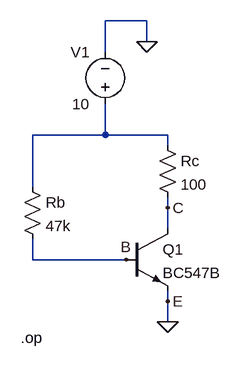
[diagram p0: schematic Fixed Bias Circuit BJT.asc]
Fixed Bias Circuit BJT.asc, the LTspice schematic file:
Version 4
SHEET 1 880 680
WIRE 224 -128 160 -128
WIRE 224 -96 224 -128
WIRE 160 -80 160 -128
WIRE 160 48 160 0
WIRE 160 48 48 48
WIRE 256 48 160 48
WIRE 256 64 256 48
WIRE 48 128 48 48
WIRE 256 160 256 144
WIRE 256 192 256 160
WIRE 48 240 48 208
WIRE 192 240 48 240
WIRE 256 304 256 288
WIRE 256 336 256 304
FLAG 256 336 0
FLAG 224 -96 0
FLAG 192 240 B
FLAG 256 304 E
FLAG 256 160 C
SYMBOL res 32 112 R0
SYMATTR InstName Rb
SYMATTR Value 47k
SYMBOL res 240 48 R0
SYMATTR InstName Rc
SYMATTR Value 100
SYMBOL npn 192 192 R0
SYMATTR InstName Q1
SYMATTR Value BC547B
SYMBOL voltage 160 16 R180
WINDOW 0 24 96 Left 2
WINDOW 3 24 16 Left 2
WINDOW 123 0 0 Left 0
WINDOW 39 0 0 Left 0
SYMATTR InstName V1
SYMATTR Value 10
TEXT 30 360 Left 2 !.op

The netlist it stands for:
* Fixed Bias Circuit BJT.asc
Rb N001 B 47k
Rc N001 C 100
Q1 C B 0 0 BC547B
V1 N001 0 10
.model NPN NPN
.model PNP PNP
.lib standard.bjt
.op
.backanno
.end